# EAGLE design qfp160_socket_new (EAGLE 9.6.2)
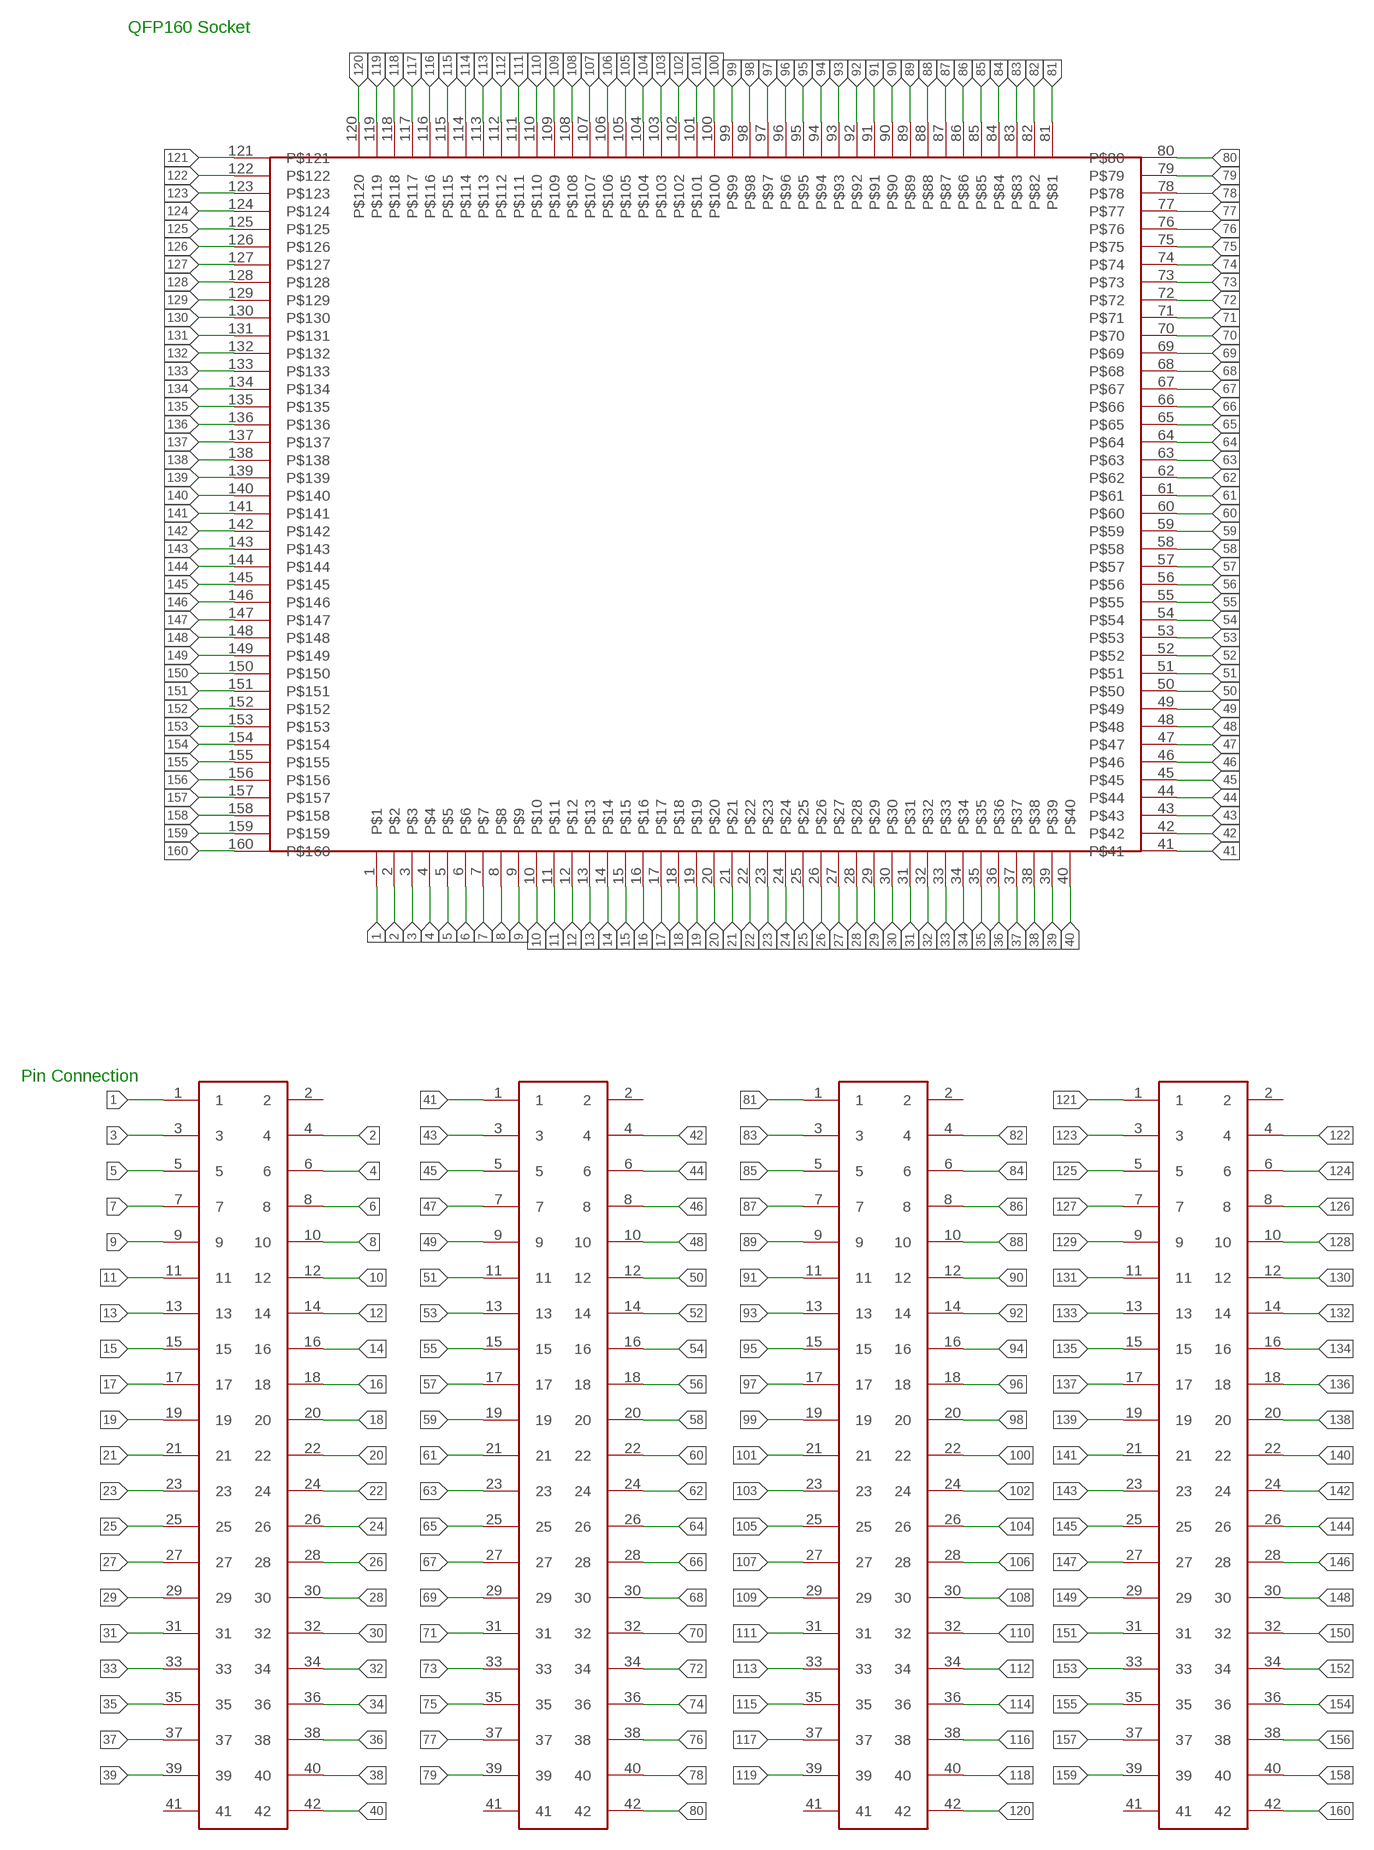
[diagram p0: schematic, sheet 1]

## Parts
U$1  2X41_HEADER  [2X41_HEADER]
U$2  2X41_HEADER  [2X41_HEADER]
U$3  2X41_HEADER  [2X41_HEADER]
U$4  2X41_HEADER  [2X41_HEADER]
U$5  QFP160_SOCKET  [QFP160_SOCKET]

## Nets
1: U$1.1 U$5.1
2: U$1.4 U$5.2
3: U$1.3 U$5.3
4: U$1.6 U$5.4
5: U$1.5 U$5.5
6: U$1.8 U$5.6
7: U$1.7 U$5.7
8: U$1.10 U$5.8
9: U$1.9 U$5.9
10: U$1.12 U$5.10
11: U$1.11 U$5.11
12: U$1.14 U$5.12
13: U$1.13 U$5.13
14: U$1.16 U$5.14
15: U$1.15 U$5.15
16: U$1.18 U$5.16
17: U$1.17 U$5.17
18: U$1.20 U$5.18
19: U$1.19 U$5.19
20: U$1.22 U$5.20
21: U$1.21 U$5.21
22: U$1.24 U$5.22
23: U$1.23 U$5.23
24: U$1.26 U$5.24
25: U$1.25 U$5.25
26: U$1.28 U$5.26
27: U$1.27 U$5.27
28: U$1.30 U$5.28
29: U$1.29 U$5.29
30: U$1.32 U$5.30
31: U$1.31 U$5.31
32: U$1.34 U$5.32
33: U$1.33 U$5.33
34: U$1.36 U$5.34
35: U$1.35 U$5.35
36: U$1.38 U$5.36
37: U$1.37 U$5.37
38: U$1.40 U$5.38
39: U$1.39 U$5.39
40: U$1.42 U$5.40
41: U$2.1 U$5.41
42: U$2.4 U$5.42
43: U$2.3 U$5.43
44: U$2.6 U$5.44
45: U$2.5 U$5.45
46: U$2.8 U$5.46
47: U$2.7 U$5.47
48: U$2.10 U$5.48
49: U$2.9 U$5.49
50: U$2.12 U$5.50
51: U$2.11 U$5.51
52: U$2.14 U$5.52
53: U$2.13 U$5.53
54: U$2.16 U$5.54
55: U$2.15 U$5.55
56: U$2.18 U$5.56
57: U$2.17 U$5.57
58: U$2.20 U$5.58
59: U$2.19 U$5.59
60: U$2.22 U$5.60
61: U$2.21 U$5.61
62: U$2.24 U$5.62
63: U$2.23 U$5.63
64: U$2.26 U$5.64
65: U$2.25 U$5.65
66: U$2.28 U$5.66
67: U$2.27 U$5.67
68: U$2.30 U$5.68
69: U$2.29 U$5.69
70: U$2.32 U$5.70
71: U$2.31 U$5.71
72: U$2.34 U$5.72
73: U$2.33 U$5.73
74: U$2.36 U$5.74
75: U$2.35 U$5.75
76: U$2.38 U$5.76
77: U$2.37 U$5.77
78: U$2.40 U$5.78
79: U$2.39 U$5.79
80: U$2.42 U$5.80
81: U$3.1 U$5.81
82: U$3.4 U$5.82
83: U$3.3 U$5.83
84: U$3.6 U$5.84
85: U$3.5 U$5.85
86: U$3.8 U$5.86
87: U$3.7 U$5.87
88: U$3.10 U$5.88
89: U$3.9 U$5.89
90: U$3.12 U$5.90
91: U$3.11 U$5.91
92: U$3.14 U$5.92
93: U$3.13 U$5.93
94: U$3.16 U$5.94
95: U$3.15 U$5.95
96: U$3.18 U$5.96
97: U$3.17 U$5.97
98: U$3.20 U$5.98
99: U$3.19 U$5.99
100: U$3.22 U$5.100
101: U$3.21 U$5.101
102: U$3.24 U$5.102
103: U$3.23 U$5.103
104: U$3.26 U$5.104
105: U$3.25 U$5.105
106: U$3.28 U$5.106
107: U$3.27 U$5.107
108: U$3.30 U$5.108
109: U$3.29 U$5.109
110: U$3.32 U$5.110
111: U$3.31 U$5.111
112: U$3.34 U$5.112
113: U$3.33 U$5.113
114: U$3.36 U$5.114
115: U$3.35 U$5.115
116: U$3.38 U$5.116
117: U$3.37 U$5.117
118: U$3.40 U$5.118
119: U$3.39 U$5.119
120: U$3.42 U$5.120
121: U$4.1 U$5.121
122: U$4.4 U$5.122
123: U$4.3 U$5.123
124: U$4.6 U$5.124
125: U$4.5 U$5.125
126: U$4.8 U$5.126
127: U$4.7 U$5.127
128: U$4.10 U$5.128
129: U$4.9 U$5.129
130: U$4.12 U$5.130
131: U$4.11 U$5.131
132: U$4.14 U$5.132
133: U$4.13 U$5.133
134: U$4.16 U$5.134
135: U$4.15 U$5.135
136: U$4.18 U$5.136
137: U$4.17 U$5.137
138: U$4.20 U$5.138
139: U$4.19 U$5.139
140: U$4.22 U$5.140
141: U$4.21 U$5.141
142: U$4.24 U$5.142
143: U$4.23 U$5.143
144: U$4.26 U$5.144
145: U$4.25 U$5.145
146: U$4.28 U$5.146
147: U$4.27 U$5.147
148: U$4.30 U$5.148
149: U$4.29 U$5.149
150: U$4.32 U$5.150
151: U$4.31 U$5.151
152: U$4.34 U$5.152
153: U$4.33 U$5.153
154: U$4.36 U$5.154
155: U$4.35 U$5.155
156: U$4.38 U$5.156
157: U$4.37 U$5.157
158: U$4.40 U$5.158
159: U$4.39 U$5.159
160: U$4.42 U$5.160
Unconnected: U$1.2 U$1.41 U$2.2 U$2.41 U$3.2 U$3.41 U$4.2 U$4.41

## Notes on the sheet
- QFP160 Socket
- Pin Connection

## Library data of the parts
U$1-U$4 = Duy:2X41_HEADER
U$5 = qfp160:QFP160_SOCKET

## Board
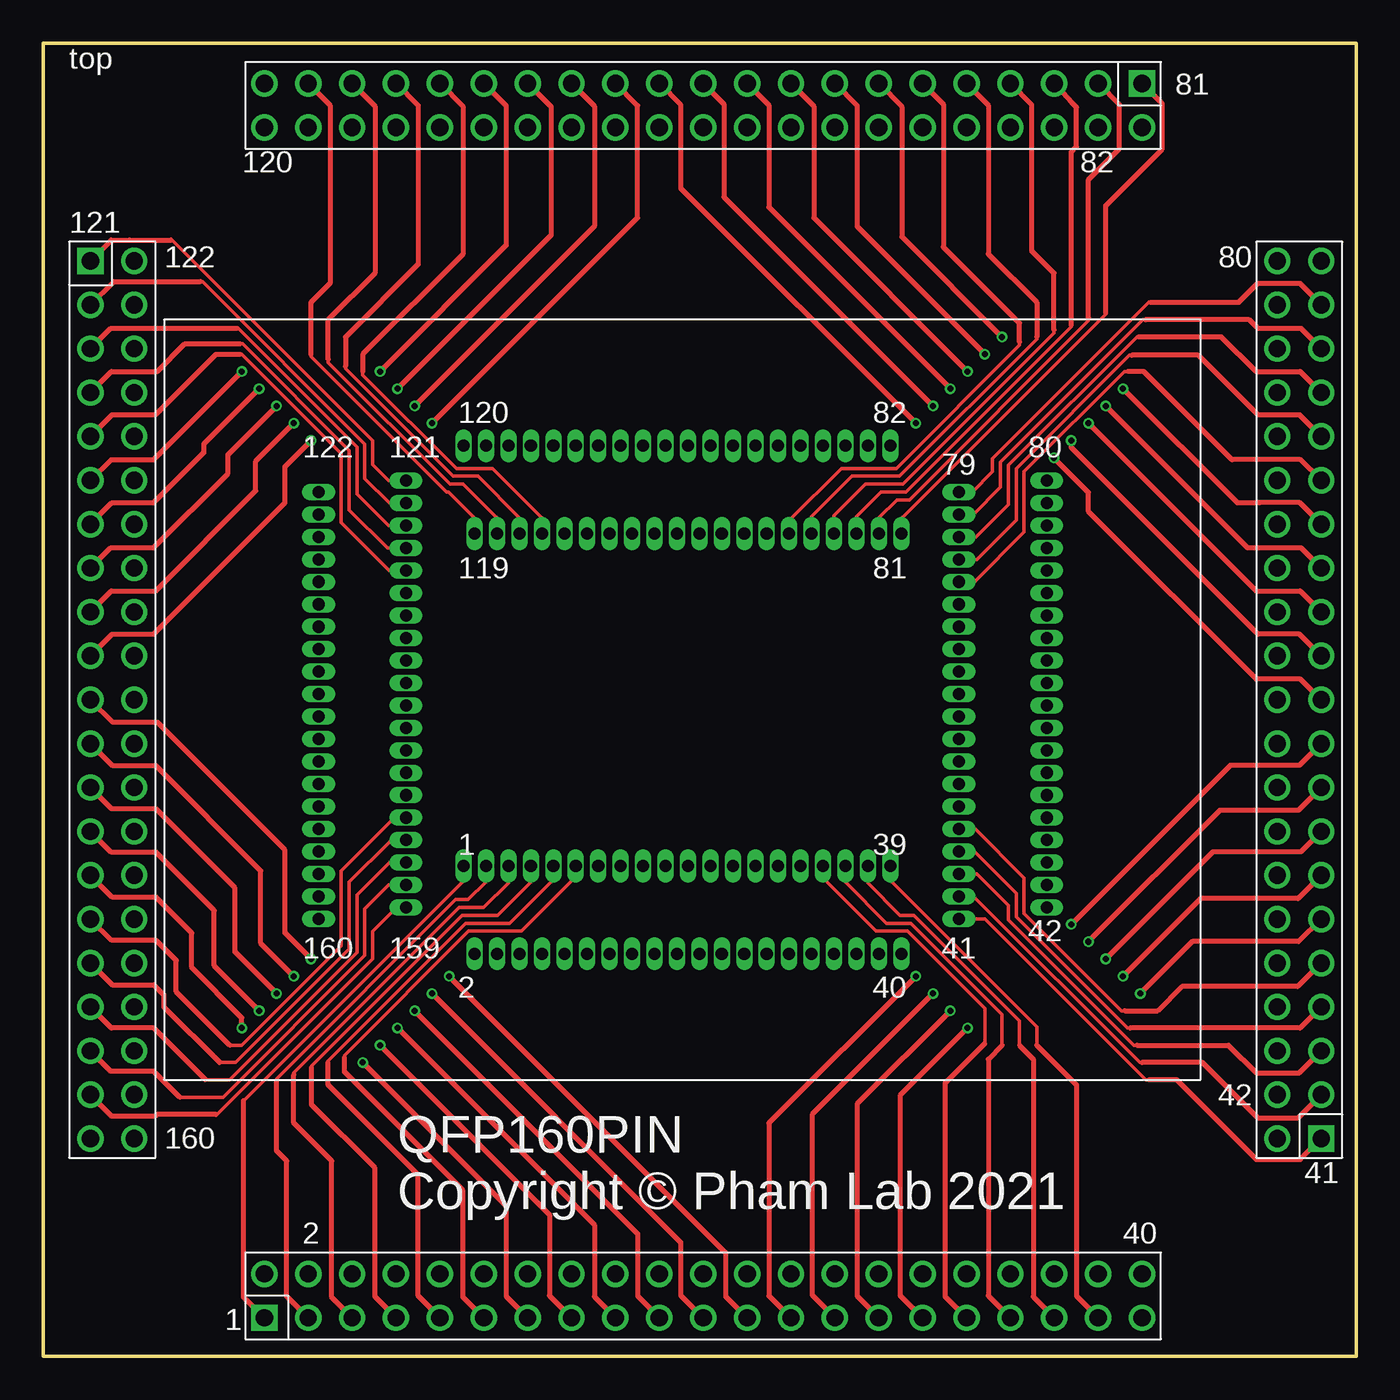
[diagram p1: board, top side]
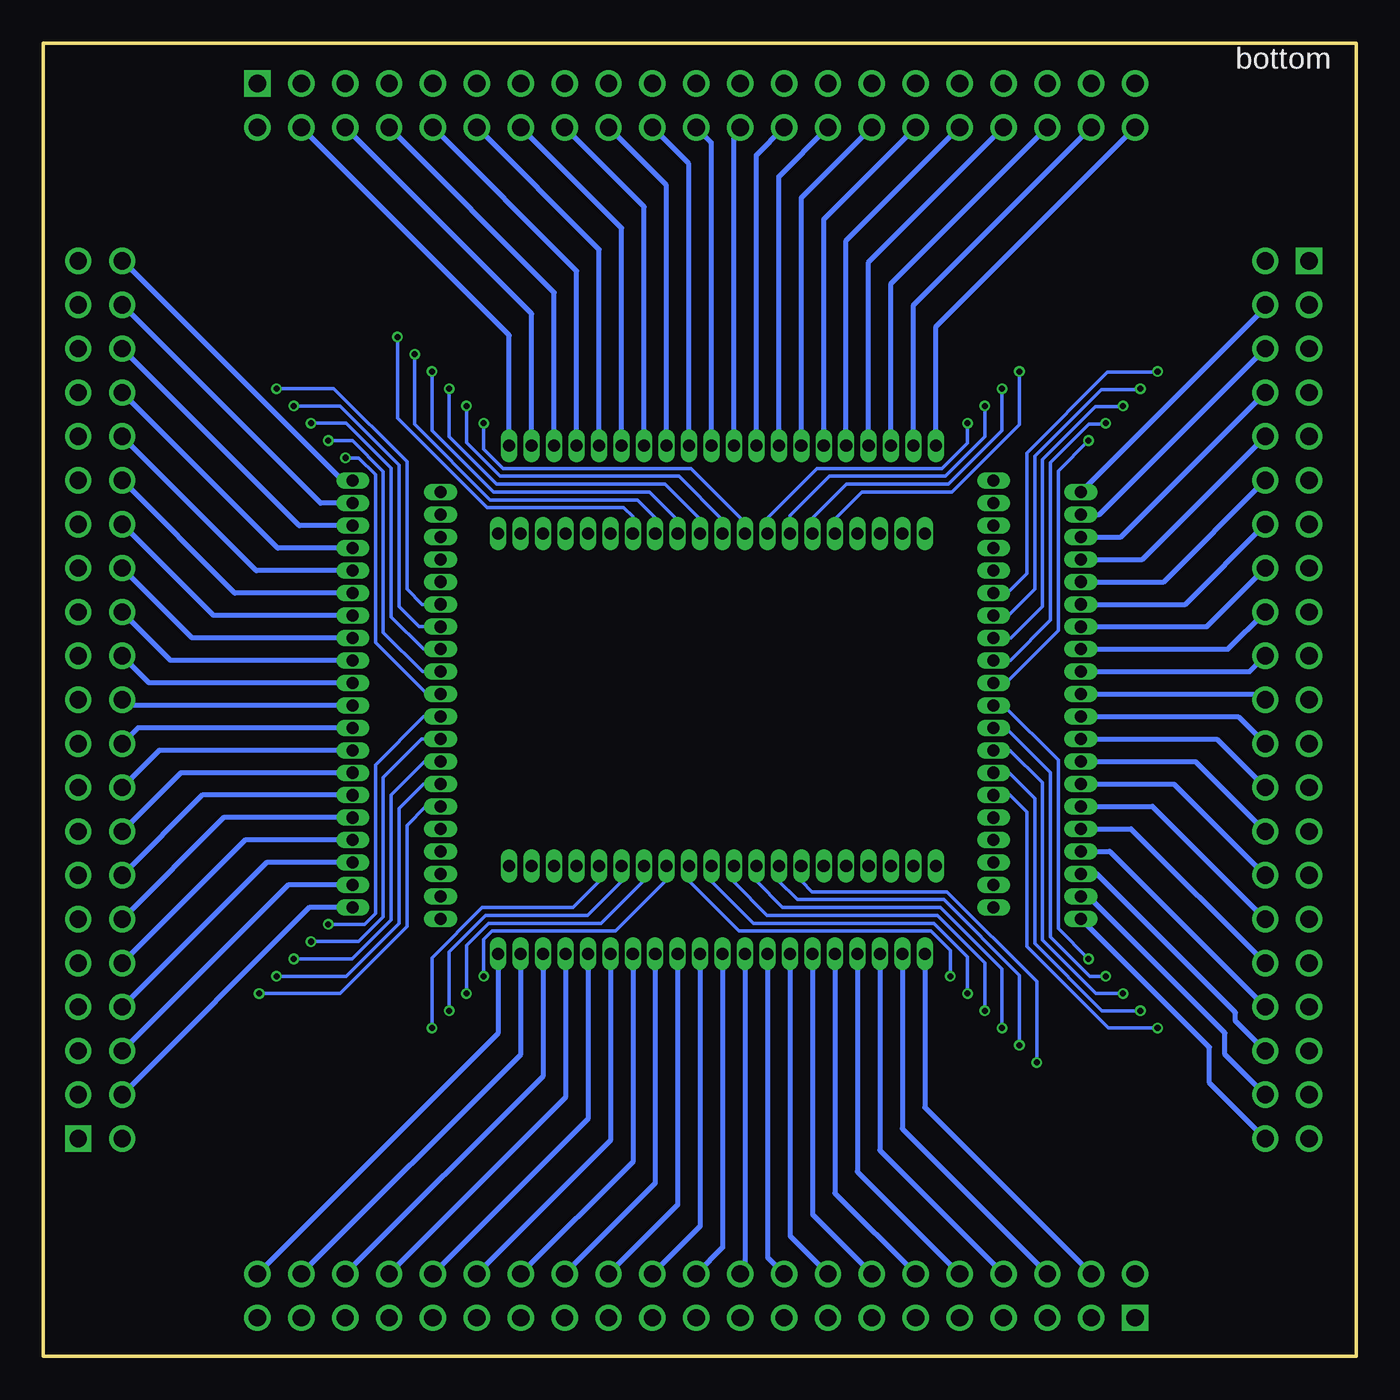
[diagram p2: board, bottom side, seen from below]

Size 76 x 76 mm. Coordinates in mm from the lower left corner, seen from the top.
Outline: 0,76 76,76 76,0 0,0 0,76
Copper layers (1*16): Top 0.035mm / dielectric 1.5mm / Bottom 0.035mm
Design rules "default *": minimum track width 6mil, minimum drill 0.35mm, track to track 10mil, track to pad 10mil, pad to pad 10mil, via to via 10mil, smd to smd 10mil, copper to edge 40mil, drill to drill 6mil, minimum pad ring 0.13mm, minimum via ring 0.13mm, stop-mask expansion 4mil, vias tented up to drill 0mil, thermal gap 10mil

### Footprints (pad centres in the part's own frame; a part is rotated, then mirrored left to right if it is on the bottom)
2X41_HEADER = drill 1 pad 1.524 square: 1 -25.4,-1.27 | drill 1 pad 1.524: 2 -25.4,1.27; 3 -22.86,-1.27; 4 -22.86,1.27; 5 -20.32,-1.27; 6 -20.32,1.27; 7 -17.78,-1.27; 8 -17.78,1.27; 9 -15.24,-1.27; 10 -15.24,1.27; 11 -12.7,-1.27; 12 -12.7,1.27; 13 -10.16,-1.27; 14 -10.16,1.27; 15 -7.62,-1.27; 16 -7.62,1.27; 17 -5.08,-1.27; 18 -5.08,1.27; 19 -2.54,-1.27; 20 -2.54,1.27; 21 0,-1.27; 22 0,1.27; 23 2.54,-1.27; 24 2.54,1.27; 25 5.08,-1.27; 26 5.08,1.27; 27 7.62,-1.27; 28 7.62,1.27; 29 10.16,-1.27; 30 10.16,1.27; 31 12.7,-1.27; 32 12.7,1.27; 33 15.24,-1.27; 34 15.24,1.27; 35 17.78,-1.27; 36 17.78,1.27; 37 20.32,-1.27; 38 20.32,1.27; 39 22.86,-1.27; 40 22.86,1.27; 41 25.4,-1.27; 42 25.4,1.27
QFP160_SOCKET = drill 0.7 pad 0.7 long: 1 -12.675,-9.62; 2 -12.025,-14.7; 3 -11.375,-9.62; 4 -10.725,-14.7; 5 -10.075,-9.62; 6 -9.425,-14.7; 7 -8.775,-9.62; 8 -8.125,-14.7; 9 -7.475,-9.62; 10 -6.825,-14.7; 11 -6.175,-9.62; 12 -5.525,-14.7; 13 -4.875,-9.62; 14 -4.225,-14.7; 15 -3.575,-9.62; 16 -2.925,-14.7; 17 -2.275,-9.62; 18 -1.625,-14.7; 19 -0.975,-9.62; 20 -0.325,-14.7; 21 0.325,-9.62; 22 0.975,-14.7; 23 1.625,-9.62; 24 2.275,-14.7; 25 2.925,-9.62; 26 3.575,-14.7; 27 4.225,-9.62; 28 4.875,-14.7; 29 5.525,-9.62; 30 6.175,-14.7; 31 6.825,-9.62; 32 7.475,-14.7; 33 8.125,-9.62; 34 8.775,-14.7; 35 9.425,-9.62; 36 10.075,-14.7; 37 10.725,-9.62; 38 11.375,-14.7; 39 12.025,-9.62; 40 12.675,-14.7; 41 16,-12.675; 42 21.08,-12.025; 43 16,-11.375; 44 21.08,-10.725; 45 16,-10.075; 46 21.08,-9.425; 47 16,-8.775; 48 21.08,-8.125; 49 16,-7.475; 50 21.08,-6.825; 51 16,-6.175; 52 21.08,-5.525; 53 16,-4.875; 54 21.08,-4.225; 55 16,-3.575; 56 21.08,-2.925; 57 16,-2.275; 58 21.08,-1.625; 59 16,-0.975; 60 21.08,-0.325; 61 16,0.325; 62 21.08,0.975; 63 16,1.625; 64 21.08,2.275; 65 16,2.925; 66 21.08,3.575; 67 16,4.225; 68 21.08,4.875; 69 16,5.525; 70 21.08,6.175; 71 16,6.825; 72 21.08,7.475; 73 16,8.125; 74 21.08,8.775; 75 16,9.425; 76 21.08,10.075; 77 16,10.725; 78 21.08,11.375; 79 16,12.025; 80 21.08,12.675; 81 12.675,9.62; 82 12.025,14.7; 83 11.375,9.62; 84 10.725,14.7; 85 10.075,9.62; 86 9.425,14.7; 87 8.775,9.62; 88 8.125,14.7; 89 7.475,9.62; 90 6.825,14.7; 91 6.175,9.62; 92 5.525,14.7; 93 4.875,9.62; 94 4.225,14.7; 95 3.575,9.62; 96 2.925,14.7; 97 2.275,9.62; 98 1.625,14.7; 99 0.975,9.62; 100 0.325,14.7; 101 -0.325,9.62; 102 -0.975,14.7; 103 -1.625,9.62; 104 -2.275,14.7; 105 -2.925,9.62; 106 -3.575,14.7; 107 -4.225,9.62; 108 -4.875,14.7; 109 -5.525,9.62; 110 -6.175,14.7; 111 -6.825,9.62; 112 -7.475,14.7; 113 -8.125,9.62; 114 -8.775,14.7; 115 -9.425,9.62; 116 -10.075,14.7; 117 -10.725,9.62; 118 -11.375,14.7; 119 -12.025,9.62; 120 -12.675,14.7; 121 -16,12.675; 122 -21.06,12.025; 123 -16,11.375; 124 -21.06,10.725; 125 -16,10.075; 126 -21.06,9.425; 127 -16,8.775; 128 -21.06,8.125; 129 -16,7.475; 130 -21.06,6.825; 131 -16,6.175; 132 -21.06,5.525; 133 -16,4.875; 134 -21.06,4.225; 135 -16,3.575; 136 -21.06,2.925; 137 -16,2.275; 138 -21.06,1.625; 139 -16,0.975; 140 -21.06,0.325; 141 -16,-0.325; 142 -21.06,-0.975; 143 -16,-1.625; 144 -21.06,-2.275; 145 -16,-2.925; 146 -21.06,-3.575; 147 -16,-4.225; 148 -21.06,-4.875; 149 -16,-5.525; 150 -21.06,-6.175; 151 -16,-6.825; 152 -21.06,-7.475; 153 -16,-8.125; 154 -21.06,-8.775; 155 -16,-9.425; 156 -21.06,-10.075; 157 -16,-10.725; 158 -21.06,-11.375; 159 -16,-12.025; 160 -21.06,-12.675

### Placement (x,y rotation side)
U$1  38.2,3.5 0 top
U$2  72.7,38 90 top
U$3  38.2,72.4 180 top
U$4  4,38 270 top
U$5  37,38 0 top

### Tracks (layer width: path | path; a pad name or v marks a point on that pad's centre or on a via)
1
  Top 0.2: U$5.1 24.32,27.52 11.6,14.8
  Top 0.3: U$1.1 11.6,3.43 11.6,12.7 11.6,14.8
2
  Bottom 0.3: U$5.2 24.98,14.41 U$1.4
3
  Top 0.2: U$5.3 25.62,27.45 24.6,26.43 23.88,26.43 13.5,16.05 13.5,15.9
  Top 0.3: U$1.3 14.1,3.47 14.1,11.3 13.5,11.9 13.5,15.9
4
  Bottom 0.3: U$5.4 26.27,13.16 U$1.6
5
  Top 0.2: U$5.5 26.93,27.4 25.5,25.98 24.06,25.98 14.5,16.41 14.5,16.3
  Top 0.3: U$1.5 16.7,3.41 16.7,11.3 14.5,13.5 14.5,16.3
6
  Bottom 0.3: U$5.6 27.57,11.93 U$1.8
7
  Top 0.2: U$5.7 28.23,27.45 26.3,25.52 24.25,25.52 15.53,16.8 15.53,16.7
  Top 0.3: U$1.7 19.2,3.45 19.2,10.9 15.53,14.57 15.53,16.7
8
  Bottom 0.3: U$5.8 28.88,10.68 U$1.10
9
  Top 0.2: U$5.9 29.52,27.59 27,25.07 24.44,25.07 16.49,17.11 16.49,17
  Top 0.3: U$1.9 21.7,3.49 21.7,10.5 16.49,15.71 16.49,17
10
  Bottom 0.3: U$5.10 30.18,9.45 U$1.12
11
  Top 0.2: U$5.11 30.82,27.74 27.7,24.61 24.63,24.61 17.44,17.43 17.44,17.3
  Top 0.3: U$1.11 24.3,3.43 24.3,9.6 17.44,16.46 17.44,17.3
12
  Bottom 0.3: U$5.12 31.48,8.2 U$1.14
13  (via drill 0.35)
  Top 0.3: v18.5,17 26.8,8.7 26.8,3.47 U$1.13
  Bottom 0.2: U$5.13 32.12,27.51 31.5,26.88 23.69,26.88 18.5,21.7 v18.5,17
14
  Bottom 0.3: U$5.14 32.77,6.96 U$1.16
15  (via drill 0.35)
  Top 0.3: v19.5,18 29.3,8.2 29.3,3.51 U$1.15
  Bottom 0.2: U$5.15 33.46,28.35 33.46,27.55 32.33,26.43 23.88,26.43 19.5,22.05 v19.5,18
16
  Bottom 0.3: U$5.16 34.08,5.73 U$1.18
17  (via drill 0.35)
  Top 0.3: v20.5,19 31.9,7.6 31.9,3.45 U$1.17
  Bottom 0.2: U$5.17 34.73,27.5 33.2,25.98 24.06,25.98 20.5,22.41 v20.5,19
18
  Bottom 0.3: U$5.18 35.38,5.05 U$1.20
19  (via drill 0.35)
  Top 0.3: v21.5,20 34.4,7.1 34.4,3.49 U$1.19
  Bottom 0.2: U$5.19 36.02,27.45 34.1,25.52 24.25,25.52 21.5,22.77 v21.5,20
20
  Bottom 0.3: U$5.20 36.67,6.3 U$1.22
21  (via drill 0.35)
  Top 0.3: v22.5,21 36.9,6.6 36.9,3.53 U$1.21
  Bottom 0.2: U$5.21 37.33,27.49 34.9,25.07 24.44,25.07 22.5,23.13 v22.5,21
22
  Bottom 0.3: U$5.22 37.98,7.54 U$1.24
23  (via drill 0.35)
  Top 0.3: v23.5,22 39.5,6 39.5,3.47 U$1.23
  Bottom 0.2: U$5.23 38.62,27.5 35.74,24.61 24.63,24.61 23.5,23.48 v23.5,22
24
  Bottom 0.3: U$5.24 39.27,8.77 U$1.26
25  (via drill 0.35)
  Top 0.3: v50.5,22 42,13.5 42,3.5 U$1.25
  Bottom 0.2: U$5.25 39.92,27.57 42.89,24.61 50.02,24.61 50.51,24.12 50.51,22.48 50.5,22.47 v50.5,22
26
  Bottom 0.3: U$5.26 40.58,10.02 U$1.28
27  (via drill 0.35)
  Top 0.3: v51.5,21 44.5,14 44.5,3.55 U$1.27
  Bottom 0.2: U$5.27 41.23,27.54 43.7,25.07 50.21,25.07 51.5,23.78 v51.5,21
28
  Bottom 0.3: U$5.28 41.88,11.25 U$1.30
29  (via drill 0.35)
  Top 0.3: v52.5,20 47.1,14.6 47.1,3.49 U$1.29
  Bottom 0.2: U$5.29 42.52,27.5 44.5,25.52 50.4,25.52 52.5,23.42 v52.5,20
30
  Bottom 0.3: U$5.30 43.17,12.5 U$1.32
31  (via drill 0.35)
  Top 0.3: v53.5,19 49.6,15.1 49.6,3.53 U$1.31
  Bottom 0.2: U$5.31 43.83,27.48 45.32,25.98 50.59,25.98 53.5,23.06 v53.5,19
32
  Bottom 0.3: U$5.32 44.48,13.73 U$1.34
33
  Top 0.2: U$5.33 45.12,27.69 48.2,24.61 50.02,24.61 54.5,20.13 54.5,18.1
  Top 0.3: 54.5,18.1 52.2,15.8 52.2,3.47 U$1.33
34
  Bottom 0.3: U$5.34 45.77,14.98 U$1.36
35
  Top 0.2: U$5.35 46.42,27.44 48.8,25.07 50.21,25.07 55.5,19.78 55.5,18
  Top 0.3: 55.5,18 54.7,17.2 54.7,3.51 U$1.35
36
  Bottom 0.3: U$5.36 47.08,16.21 U$1.38
37
  Top 0.2: U$5.37 47.73,27.4 49.6,25.52 50.4,25.52 56.5,19.42 56.5,18
  Top 0.3: 56.5,18 57.3,17.2 57.3,3.45 U$1.37
38
  Bottom 0.3: U$5.38 48.38,17.45 U$1.40
39
  Top 0.2: U$5.39 49.02,27.54 57.5,19.06 57.5,18
  Top 0.3: 57.5,18 59.8,15.7 59.8,3.49 U$1.39
40
  Bottom 0.3: U$5.40 49.67,18.7 U$1.42
41
  Top 0.2: U$5.41 54.5,25.32 63.83,16 64,16
  Top 0.3: U$2.1 72.77,11.4 70.2,11.4 65.6,16 64,16
42
  Bottom 0.3: U$5.42 60.59,25.98 U$2.4
43
  Top 0.2: U$5.43 53.84,26.62 63.47,17 63.6,17
  Top 0.3: U$2.3 72.63,13.8 70.3,13.8 67.1,17 63.6,17
44
  Bottom 0.3: U$5.44 61.84,27.27 U$2.6
45
  Top 0.2: U$5.45 54.03,27.93 55.86,26.1 55.86,25.25 63.11,18 63.3,18
  Top 0.3: U$2.5 72.69,16.4 70.2,16.4 68.6,18 63.3,18
46
  Bottom 0.3: U$5.46 63.08,28.57 U$2.8
47
  Top 0.2: U$5.47 53.89,29.23 56.31,26.8 56.31,25.44 62.75,19 62.9,19
  Top 0.3: U$2.7 72.75,19 62.9,19
48
  Bottom 0.3: U$5.48 64.31,29.88 U$2.10
49
  Top 0.2: U$5.49 53.94,30.52 56.77,27.7 56.77,25.63 62.4,20 62.6,20
  Top 0.3: U$2.9 72.61,21.4 65.9,21.4 64.5,20 62.6,20
50
  Bottom 0.3: U$5.50 65.56,31.18 U$2.12
51  (via drill 0.35)
  Top 0.3: U$2.11 72.67,24 66.5,24 v63.5,21
  Bottom 0.2: U$5.51 53.86,31.82 54.95,30.73 54.95,24.88 58.83,21 v63.5,21
52
  Bottom 0.3: U$5.52 66.8,32.48 U$2.14
53  (via drill 0.35)
  Top 0.3: U$2.13 72.63,26.5 67,26.5 v62.5,22
  Bottom 0.2: U$5.53 53.98,33.12 55.4,31.7 55.4,25.06 58.47,22 v62.5,22
54
  Bottom 0.3: U$5.54 68.03,33.77 U$2.16
55  (via drill 0.35)
  Top 0.3: U$2.15 72.79,29.2 67.7,29.2 v61.5,23
  Bottom 0.2: U$5.55 53.93,34.42 55.86,32.5 55.86,25.25 58.11,23 v61.5,23
56
  Bottom 0.3: U$5.56 69.28,35.08 U$2.18
57  (via drill 0.35)
  Top 0.3: U$2.17 72.65,31.6 68.1,31.6 v60.5,24
  Bottom 0.2: U$5.57 54.09,35.73 56.31,33.5 56.31,25.44 57.75,24 v60.5,24
58
  Bottom 0.3: U$5.58 70.52,36.38 U$2.20
59  (via drill 0.35)
  Top 0.3: U$2.19 72.71,34.2 68.7,34.2 v59.5,25
  Bottom 0.2: U$5.59 53.98,37.02 56.77,34.23 56.77,25.63 57.4,25 v59.5,25
60
  Bottom 0.3: U$5.60 71.1,37.67 U$2.22
61  (via drill 0.35)
  Top 0.3: U$2.21 72.77,39.2 70.2,39.2 60.5,48.9 60.5,50 v58.5,52
  Bottom 0.2: U$5.61 53.79,38.33 56.77,41.3 56.77,51.02 57.75,52 v58.5,52
62
  Bottom 0.3: U$5.62 69.87,38.98 U$2.24
63  (via drill 0.35)
  Top 0.3: U$2.23 72.71,41.8 70.3,41.8 59.5,52.6 v59.5,53
  Bottom 0.2: U$5.63 54.04,39.62 56.31,41.9 56.31,51.21 58.1,53 v59.5,53
64
  Bottom 0.3: U$5.64 68.62,40.27 U$2.26
65  (via drill 0.35)
  Top 0.3: U$2.25 72.75,44.3 70.2,44.3 v60.5,54
  Bottom 0.2: U$5.65 53.98,40.92 55.86,42.8 55.86,51.4 58.46,54 v60.5,54
66
  Bottom 0.3: U$5.66 67.39,41.58 U$2.28
67  (via drill 0.35)
  Top 0.3: U$2.27 72.79,46.8 69.7,46.8 v61.5,55
  Bottom 0.2: U$5.67 54.23,42.23 55.4,43.4 55.4,51.59 58.82,55 v61.5,55
68
  Bottom 0.3: U$5.68 66.14,42.88 U$2.30
69  (via drill 0.35)
  Top 0.3: U$2.29 72.73,49.4 70.4,49.4 70.2,49.4 69.1,49.4 v62.5,56
  Bottom 0.2: U$5.69 54.08,43.52 54.95,44.4 54.95,51.77 59.18,56 v62.5,56
70
  Bottom 0.3: U$5.70 64.91,44.17 U$2.32
71
  Top 0.2: U$5.71 53.89,44.83 56.77,47.7 56.77,51.2 62.57,57 62.8,57
  Top 0.3: U$2.31 72.77,51.9 68.8,51.9 63.7,57 62.8,57
72
  Bottom 0.3: U$5.72 63.66,45.48 U$2.34
73
  Top 0.2: U$5.73 54.04,46.12 56.31,48.4 56.31,51.39 62.86,57.94 63,57.94
  Top 0.3: U$2.33 72.71,54.5 70.3,54.5 66.86,57.94 63,57.94
74
  Bottom 0.3: U$5.74 62.42,46.77 U$2.36
75
  Top 0.2: U$5.75 53.98,47.42 55.86,49.3 55.86,51.57 63.28,59 63.4,59
  Top 0.3: U$2.35 72.75,57 70.2,57 68.2,59 63.4,59
76
  Bottom 0.3: U$5.76 61.19,48.08 U$2.38
77
  Top 0.2: U$5.77 53.83,48.73 55.4,50.3 55.4,51.76 63.64,60 63.8,60
  Top 0.3: U$2.37 72.79,59.5 70.3,59.5 69.8,60 63.8,60
78
  Bottom 0.3: U$5.78 59.95,49.38 U$2.40
79
  Top 0.2: U$5.79 53.77,50.02 54.95,51.2 54.95,51.95 64,61 64.1,61
  Top 0.3: U$2.39 72.73,62.1 70.3,62.1 69.2,61 64.1,61
80
  Bottom 0.3: U$5.80 58.68,50.67 71.41,63.4 U$2.42
81
  Top 0.2: U$5.81 49.67,48.48 61.5,60.3 61.5,60.4
  Top 0.3: U$3.1 64.69,72.59 64.77,72.5 64.77,69.87 61.5,66.6 61.5,60.4
82
  Bottom 0.3: U$5.82 49.02,59.09 U$3.4
83
  Top 0.2: U$5.83 48.38,48.55 49.4,49.57 50.12,49.57 60.5,59.95 60.5,60.1
  Top 0.3: U$3.3 62.3,72.43 62.3,69.9 60.5,68.1 60.5,60.1
84
  Bottom 0.3: U$5.84 47.73,60.34 U$3.6
85
  Top 0.2: U$5.85 47.08,48.6 48.5,50.02 49.94,50.02 59.5,59.59 59.5,59.7
  Top 0.3: U$3.5 59.5,72.59 59.8,72.29 59.8,70 59.5,69.7 59.5,59.7
86
  Bottom 0.3: U$5.86 46.42,61.58 U$3.8
87
  Top 0.2: U$5.87 45.77,48.65 47.6,50.48 49.75,50.48 58.5,59.23 58.5,59.4
  Top 0.3: U$3.7 57.2,72.45 57.2,64 58.5,62.7 58.5,59.4
88
  Bottom 0.3: U$5.88 45.12,62.81 U$3.10
89
  Top 0.2: U$5.89 44.48,48.61 46.8,50.93 49.56,50.93 57.5,58.87 57.5,59
  Top 0.3: U$3.9 54.7,72.41 54.7,63.8 57.5,61 57.5,59
90
  Bottom 0.3: U$5.90 43.83,64.06 U$3.12
91
  Top 0.2: U$5.91 43.17,48.36 46.2,51.39 49.37,51.39 56.5,58.52 56.5,58.7
  Top 0.3: U$3.11 52.1,72.47 52.1,64.2 56.5,59.8 56.5,58.7
92
  Bottom 0.3: U$5.92 42.52,65.3 U$3.14
93  (via drill 0.35)
  Top 0.3: U$3.13 49.7,72.33 49.7,64.8 v55.5,59
  Bottom 0.2: U$5.93 41.88,48.59 42.4,49.12 50.31,49.12 55.5,54.3 v55.5,59
94
  Bottom 0.3: U$5.94 41.23,66.53 U$3.16
95  (via drill 0.35)
  Top 0.3: U$3.15 47.1,72.39 47.1,65.4 v54.5,58
  Bottom 0.2: U$5.95 40.58,48.55 41.6,49.57 50.12,49.57 54.5,53.95 v54.5,58
96
  Bottom 0.3: U$5.96 39.92,67.78 U$3.18
97  (via drill 0.35)
  Top 0.3: U$3.17 44.6,72.35 44.6,65.9 v53.5,57
  Bottom 0.2: U$5.97 39.27,48.4 40.9,50.02 49.94,50.02 53.5,53.59 v53.5,57
98
  Bottom 0.3: U$5.98 38.62,69.02 U$3.20
99  (via drill 0.35)
  Top 0.3: U$3.19 42,72.41 42,66.5 v52.5,56
  Bottom 0.2: U$5.99 37.98,48.45 40,50.48 49.75,50.48 52.5,53.23 v52.5,56
100
  Bottom 0.3: U$5.100 37.33,70.25 U$3.22
101  (via drill 0.35)
  Top 0.3: U$3.21 39.4,72.47 39.4,67.1 v51.5,55
  Bottom 0.2: U$5.101 36.67,48.41 39.2,50.93 49.56,50.93 51.5,52.87 v51.5,55
102
  Bottom 0.3: U$5.102 36.02,70.77 U$3.24
103  (via drill 0.35)
  Top 0.3: U$3.23 36.9,72.43 36.9,67.6 v50.5,54
  Bottom 0.2: U$5.103 35.38,48.26 38.5,51.39 49.37,51.39 50.5,52.52 v50.5,54
104
  Bottom 0.3: U$5.104 34.73,69.53 U$3.26
105  (via drill 0.35)
  Top 0.3: v22.5,54 34.4,65.9 34.4,72.39 U$3.25
  Bottom 0.2: U$5.105 34.08,48.52 31.21,51.39 23.98,51.39 22.5,52.87 v22.5,54
106
  Bottom 0.3: U$5.106 33.42,68.28 U$3.28
107  (via drill 0.35)
  Top 0.3: U$3.27 31.9,72.35 31.9,65.4 v21.5,55
  Bottom 0.2: U$5.107 32.77,48.66 30.5,50.93 23.79,50.93 21.5,53.22 v21.5,55
108
  Bottom 0.3: U$5.108 32.12,67.05 U$3.30
109  (via drill 0.35)
  Top 0.3: U$3.29 29.4,72.31 29.4,64.9 v20.5,56
  Bottom 0.2: U$5.109 31.48,48.5 29.5,50.48 23.6,50.48 20.5,53.58 v20.5,56
110
  Bottom 0.3: U$5.110 30.82,65.81 U$3.32
111  (via drill 0.35)
  Top 0.3: U$3.31 26.8,72.37 26.8,64.3 v19.5,57
  Bottom 0.2: U$5.111 30.18,48.45 28.6,50.02 23.41,50.02 19.5,53.94 v19.5,57
112
  Bottom 0.3: U$5.112 29.52,64.56 U$3.34
113
  Top 0.2: U$5.113 28.88,48.52 26.01,51.39 23.91,51.39 18.5,56.8 18.5,57
  Top 0.3: U$3.33 24.3,72.33 24.3,63.8 18.5,58 18.5,57
114
  Bottom 0.3: U$5.114 28.23,63.33 U$3.36
115
  Top 0.2: U$5.115 27.57,48.52 25.17,50.93 23.73,50.93 17.5,57.16 17.5,57.3
  Top 0.3: 17.5,57.3 17.5,59 21.7,63.2 21.7,72.39 U$3.35
116
  Bottom 0.3: U$5.116 26.93,62.09 U$3.38
117
  Top 0.2: U$5.117 26.27,48.5 24.3,50.48 23.54,50.48 16.5,57.52 16.5,57.7
  Top 0.3: 16.5,57.7 16.5,60 19.2,62.7 19.2,72.35 U$3.37
118
  Bottom 0.3: U$5.118 25.62,60.84 U$3.40
119
  Top 0.2: U$5.119 24.98,48.52 23.48,50.02 23.35,50.02 15.5,57.87 15.5,58
  Top 0.3: U$3.39 16.6,72.41 16.6,62.1 15.5,61 15.5,58
120
  Bottom 0.3: U$5.120 24.32,59.61 U$3.42
121
  Top 0.2: U$5.121 20,50.67 19.07,51.6 19.07,53 7.47,64.6 7.4,64.6
  Top 0.3: U$4.1 3.93,64.6 5,64.6 7.4,64.6
122
  Bottom 0.3: U$5.122 5.27,60.7 U$4.4
123
  Top 0.2: U$5.123 20.04,49.38 18.62,50.8 18.62,52.81 9.23,62.2 9.1,62.2
  Top 0.3: U$4.3 4.07,62.2 9.1,62.2
124
  Bottom 0.3: U$5.124 14.86,48.73 U$4.6
125
  Top 0.2: U$5.125 19.99,48.08 18.16,49.9 18.16,52.62 11.28,59.5 11.2,59.5
  Top 0.3: U$4.5 3.91,59.5 6.3,59.5 6.4,59.5 11.2,59.5
126
  Bottom 0.3: U$5.126 13.62,47.42 U$4.8
127
  Top 0.2: U$5.127 19.93,46.77 17.71,48.99 17.71,52.43 11.54,58.6 11.4,58.6
  Top 0.3: U$4.7 3.95,57 6.6,57 8.2,58.6 11.4,58.6
128
  Bottom 0.3: U$5.128 12.39,46.12 U$4.10
129
  Top 0.2: U$5.129 20.02,45.48 17.25,48.25 17.25,52.25 11.5,58 11.4,58
  Top 0.3: U$4.9 3.99,54.5 6.5,54.5 10,58 11.4,58
130
  Bottom 0.3: U$5.130 11.14,44.83 U$4.12
131  (via drill 0.35)
  Top 0.3: U$4.11 3.93,51.9 6.4,51.9 v11.5,57
  Bottom 0.2: U$5.131 20.2,44.17 19.07,45.3 19.07,52.29 14.4,56.96 11.54,56.96 v11.5,57
132
  Bottom 0.3: U$5.132 9.91,43.52 U$4.14
133  (via drill 0.35)
  Top 0.3: U$4.13 3.97,49.4 6.4,49.4 9.3,52.3 9.3,52.4 9.3,52.8 v12.5,56
  Bottom 0.2: U$5.133 20.14,42.88 18.62,44.4 18.62,52.1 14.76,55.96 12.54,55.96 v12.5,56
134
  Bottom 0.3: U$5.134 8.66,42.23 U$4.16
135  (via drill 0.35)
  Top 0.3: U$4.15 3.91,46.8 6.4,46.8 10.7,51.1 10.7,52.2 v13.5,55
  Bottom 0.2: U$5.135 19.99,41.58 18.16,43.4 18.16,51.91 15.11,54.96 13.54,54.96 v13.5,55
136
  Bottom 0.3: U$5.136 7.43,40.92 U$4.18
137  (via drill 0.35)
  Top 0.3: U$4.17 3.95,44.3 6.5,44.3 12.3,50.1 12.3,51.8 v14.5,54
  Bottom 0.2: U$5.137 20.03,40.27 17.71,42.6 17.71,51.72 15.47,53.96 14.54,53.96 v14.5,54
138
  Bottom 0.3: U$5.138 6.18,39.62 U$4.20
139  (via drill 0.35)
  Top 0.3: U$4.19 3.99,41.8 6.4,41.8 14,49.4 14,51.5 v15.5,53
  Bottom 0.2: U$5.139 20.28,38.98 17.25,42 17.25,51.25 v15.5,53
140
  Bottom 0.3: U$5.140 5.59,38.33 U$4.22
141  (via drill 0.35)
  Top 0.3: U$4.21 4.03,36.7 6.6,36.7 14,29.3 14,24.5 v15.5,23
  Bottom 0.2: U$5.141 20.43,37.67 17.25,34.5 17.25,24.75 v15.5,23
142
  Bottom 0.3: U$5.142 6.84,37.02 U$4.24
143  (via drill 0.35)
  Top 0.3: U$4.23 3.99,34.2 6.5,34.2 12.6,28.1 12.6,23.9 v14.5,22
  Bottom 0.2: U$5.143 20.28,36.38 17.71,33.8 17.71,24.28 15.43,22 v14.5,22
144
  Bottom 0.3: U$5.144 8.07,35.73 U$4.26
145  (via drill 0.35)
  Top 0.3: U$4.25 3.95,31.7 6.5,31.7 11.1,27.1 11.1,23.4 v13.5,21
  Bottom 0.2: U$5.145 20.04,35.08 18.16,33.2 18.16,24.09 15.07,21 v13.5,21
146
  Bottom 0.3: U$5.146 9.32,34.42 U$4.28
147  (via drill 0.35)
  Top 0.3: U$4.27 3.91,29.2 6.5,29.2 9.9,25.8 9.9,22.6 v12.5,20
  Bottom 0.2: U$5.147 20.09,33.77 18.62,32.3 18.62,23.9 14.72,20 v12.5,20
148
  Bottom 0.3: U$5.148 10.55,33.12 U$4.30
149  (via drill 0.35)
  Top 0.3: U$4.29 3.97,26.6 6.5,26.6 8.6,24.5 8.6,22.5 11.5,19.6 v11.5,19
  Bottom 0.2: U$5.149 20.05,32.48 19.07,31.5 19.07,23.71 14.36,19 v11.5,19
150
  Bottom 0.3: U$5.150 11.8,31.82 U$4.32
151
  Top 0.2: U$5.151 20.33,31.18 17.25,28.1 17.25,23.75 11.5,18 10.8,18
  Top 0.3: U$4.31 3.93,24.1 6.5,24.1 7.7,22.9 7.7,21.1 10.8,18
152
  Bottom 0.3: U$5.152 13.04,30.52 U$4.34
153
  Top 0.2: U$5.153 20.93,29.81 20.07,29.81 17.71,27.44 17.71,23.57 11.14,17 10.2,17
  Top 0.3: U$4.33 3.99,21.5 6.4,21.5 7,20.9 7,20.2 10.2,17
154
  Bottom 0.3: U$5.154 14.27,29.23 U$4.36
155
  Top 0.2: U$5.155 20.04,28.57 18.16,26.7 18.16,23.38 10.78,16 9.4,16
  Top 0.3: U$4.35 3.95,19 6.4,19 9.4,16
156
  Bottom 0.3: U$4.38 7,19.41 7,19.9 15.02,27.93 U$5.156
157
  Top 0.2: U$5.157 19.99,27.27 18.62,25.9 18.62,23.19 10.43,15 7.9,15
  Top 0.3: U$4.37 3.91,16.5 6.4,16.5 7.9,15
158
  Bottom 0.3: U$4.40 7.6,17.47 7.6,18.71 15.51,26.62 U$5.158
159
  Top 0.2: U$5.159 20.45,25.98 19.07,24.6 19.07,23 10.07,14 10,14
  Top 0.3: U$4.39 3.97,13.9 6.5,13.9 6.6,14 10,14
160
  Bottom 0.3: U$4.42 8.5,15.83 8.5,17.89 U$5.160

### Text on the board
tNames: top | 81 | 120 | 82 | 121 | 122 | 80 | 42 | 160 | 41 | QFP160PIN / Copyright © Pham Lab 2021 | 2 | 40 | 1
bNames: bottom